# Altium schematic sheet Sheet1.SchDoc
size A4
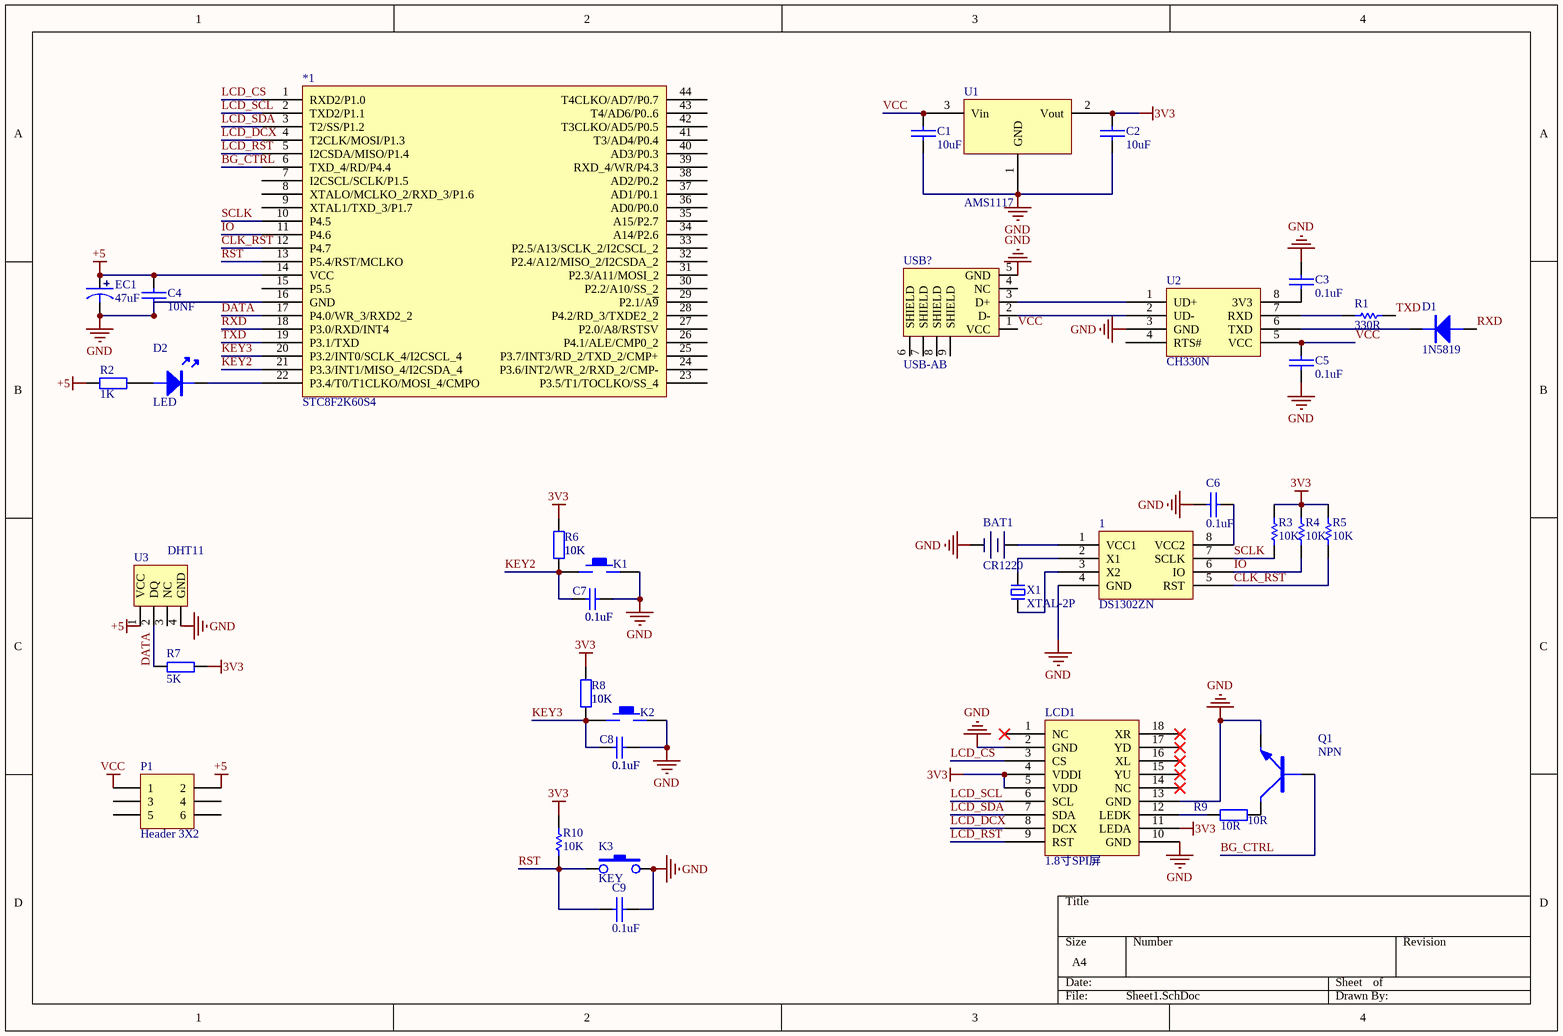
[diagram p0: Sheet1.SchDoc]

## Parts
1  DS1302ZN  [SOP8]
*1  STC8F2K60S4  [LQFP44]
BAT1  CR1220  [CR1220-A]
C1  10uF  [0603C]
C2  10uF  [0603C]
C3  0.1uF  [0603C]
C4  10NF  [0603C]
C5  0.1uF  [0603C]
C6  0.1uF  [0603C]
C7  0.1uF  [0603C]
C8  0.1uF  [0603C]
C9  0.1uF  [0603C]
D1  1N5819  [SOD-323]
D2  LED  [LED-0603B]
EC1  47uF  [SMD-EC4.0X4.3X5.4]
K1  KEY_M  [SMD-6X6X5]  (value not drawn)
K2  KEY_M  [SMD-6X6X5]  (value not drawn)
K3  KEY  [SMD-6X6X5]
LCD1  1.8寸SPI屏  [FPC0.5-14P]
P1  Header 3X2  [KFT DIP-7X7]
Q1  NPN  [SOT-23]
R1  330R  [0603R]
R2  1K  [0603R]
R3  10K  [0603R]
R4  10K  [0603R]
R5  10K  [0603R]
R6  10K  [0603R]
R7  5K  [0603R]
R8  10K  [0603R]
R9  10R  [0603R]
R10  10K  [0603R]
U1  AMS1117  [SOT223]
U2  CH330N  [sop8]
U3  DHT11  [Fe-HDR1X4/2.54-S]
USB?  USB-AB  [USB-micro_B]
X1  XTAL-2P  [OSC 3215-2P]

## Nets
3V3: C2.2 LCD1.4(VDDI) LCD1.5(VDD) LCD1.11(LEDA) R3.2 R4.2 R5.2 R6.2 R7.2 R8.2 R10.2 U1.2(Vout)
+5: *1.14(VCC) C4.2 EC1.1 P1.2 R2.1 U3.1(VCC)
GND: 1.4(GND) *1.16(GND) BAT1.2 C1.1 C2.1 C3.2 C4.1 C5.1 C6.1 C7.1 C8.1 C9.2 EC1.2 K1.2 K2.2 K3.3 LCD1.2(GND) LCD1.10(GND) LCD1.13(GND) Q1.E U1.1(GND) U2.3(GND) U3.4(GND) USB?.5(GND)
VCC: C1.2 C5.2 P1.1 U1.3(Vin) U2.5(VCC) USB?.1(VCC)
BG_CTRL: *1.6(TXD_4/RD/P4.4) Q1.B
CLK_RST: 1.5(RST) *1.12(P4.7) R5.1
DATA: *1.17(P4.0/WR_3/RXD2_2) R7.1 U3.2(DQ)
IO: 1.6(IO) *1.11(P4.6) R4.1
KEY2: *1.21(P3.3/INT1/MISO_4/I2CSDA_4) C7.2 K1.1 R6.1
KEY3: *1.20(P3.2/INT0/SCLK_4/I2CSCL_4) C8.2 K2.1 R8.1
LCD_CS: *1.1(RXD2/P1.0) LCD1.3(CS)
LCD_DCX: *1.4(T2CLK/MOSI/P1.3) LCD1.8(DCX)
LCD_RST: *1.5(I2CSDA/MISO/P1.4) LCD1.9(RST)
LCD_SCL: *1.2(TXD2/P1.1) LCD1.6(SCL)
LCD_SDA: *1.3(T2/SS/P1.2) LCD1.7(SDA)
RST: *1.13(P5.4/RST/MCLKO) C9.1 K3.1 R10.1
RXD: *1.18(P3.0/RXD/INT4) D1.A
SCLK: 1.7(SCLK) *1.10(P4.5) R3.1
TXD: *1.19(P3.1/TXD) R1.2
Net1_1: 1.1(VCC1) BAT1.1
Net1_2: 1.2(X1) X1.2
Net1_3: 1.3(X2) X1.1
Net1_8: 1.8(VCC2) C6.2
Net*1_22: *1.22(P3.4/T0/T1CLKO/MOSI_4/CMPO) D2.K
NetC3_1: C3.1 U2.8(3V3)
NetD1_K: D1.K U2.6(TXD)
NetD2_A: D2.A R2.2
NetLCD1_12: LCD1.12(LEDK) R9.1
NetQ1_C: Q1.C R9.2
NetR1_1: R1.1 U2.7(RXD)
NetU2_1: U2.1(UD+) USB?.3(D+)
NetU2_2: U2.2(UD-) USB?.2(D-)

Not connected (* = marked no-connect by the designer): *1 7(I2CSCL/SCLK/P1.5) 8(XTALO/MCLKO_2/RXD_3/P1.6) 9(XTAL1/TXD_3/P1.7) 15(P5.5) 23(P3.5/T1/TOCLKO/SS_4) 24(P3.6/INT2/WR_2/RXD_2/CMP-) 25(P3.7/INT3/RD_2/TXD_2/CMP+) 26(P4.1/ALE/CMP0_2) 27(P2.0/A8/RSTSV) 28(P4.2/RD_3/TXDE2_2) 29(P2.1/A~{9}) 30(P2.2/A10/SS_2) 31(P2.3/A11/MOSI_2) 32(P2.4/A12/MISO_2/I2CSDA_2) 33(P2.5/A13/SCLK_2/I2CSCL_2) 34(A14/P2.6) 35(A15/P2.7) 36(AD0/P0.0) 37(AD1/P0.1) 38(AD2/P0.2) 39(RXD_4/WR/P4.3) 40(AD3/P0.3) 41(T3/AD4/P0.4) 42(T3CLKO/AD5/P0.5) 43(T4/AD6/P0..6) 44(T4CLKO/AD7/P0.7); LCD1 1(NC)* 14(NC)* 15(YU)* 16(XL)* 17(YD)* 18(XR)*; P1 3 4 5 6; U2 4(RTS#); U3 3(NC); USB? 4(NC) 6(SHIELD) 7(SHIELD) 8(SHIELD) 9(SHIELD)

## Library data of the parts
C1-C6 C9 = CAP: 无极性电容
C7 C8 = Cap: Capacitor; Published: 8-Jun-2000; LatestRevisionDate: 17-Jul-2002; LatestRevisionNote: Re-released for DXP Platform.; PackageReference: RAD-0.3; Publisher: Altium Limited; PackageDescription: Radial Cap, Thru-Hole; 2 Leads; 0.3 in Pin Spacing; Value: 0.1uF
D1 = DIODE: 普通二极管
EC1 = SMD_ECAP: 贴片电解电容
P1 = Header 3X2: Header, 3-Pin, Dual row; LatestRevisionDate: 17-Jul-2002; LatestRevisionNote: Re-released for DXP Platform.; Publisher: Altium Limited
Q1 = NPN: NPN三极管
R1 R3-R5 R10 = RES
R2 R6 R8 R9 = Res2: Resistor; Published: 8-Jun-2000; LatestRevisionDate: 17-Jul-2002; LatestRevisionNote: Re-released for DXP Platform.; PackageReference: AXIAL-0.4; Publisher: Altium Limited; PackageDescription: Axial Device, Thru-Hole; 2 Leads; 0.4 in Pin Spacing
  R2: Value: 1K
  R6 R8: Value: 10K
  R9: Value: 10R
R7 = R
U1 = AMS1117: 三端稳压芯片
U3 = DHT11: 数字温湿度传感器
USB? = USB-AB: MicroUSB
X1 = XTAL-2P: 2脚无源脚晶振